# Altium schematic sheet Digit_Board.SchDoc
size A
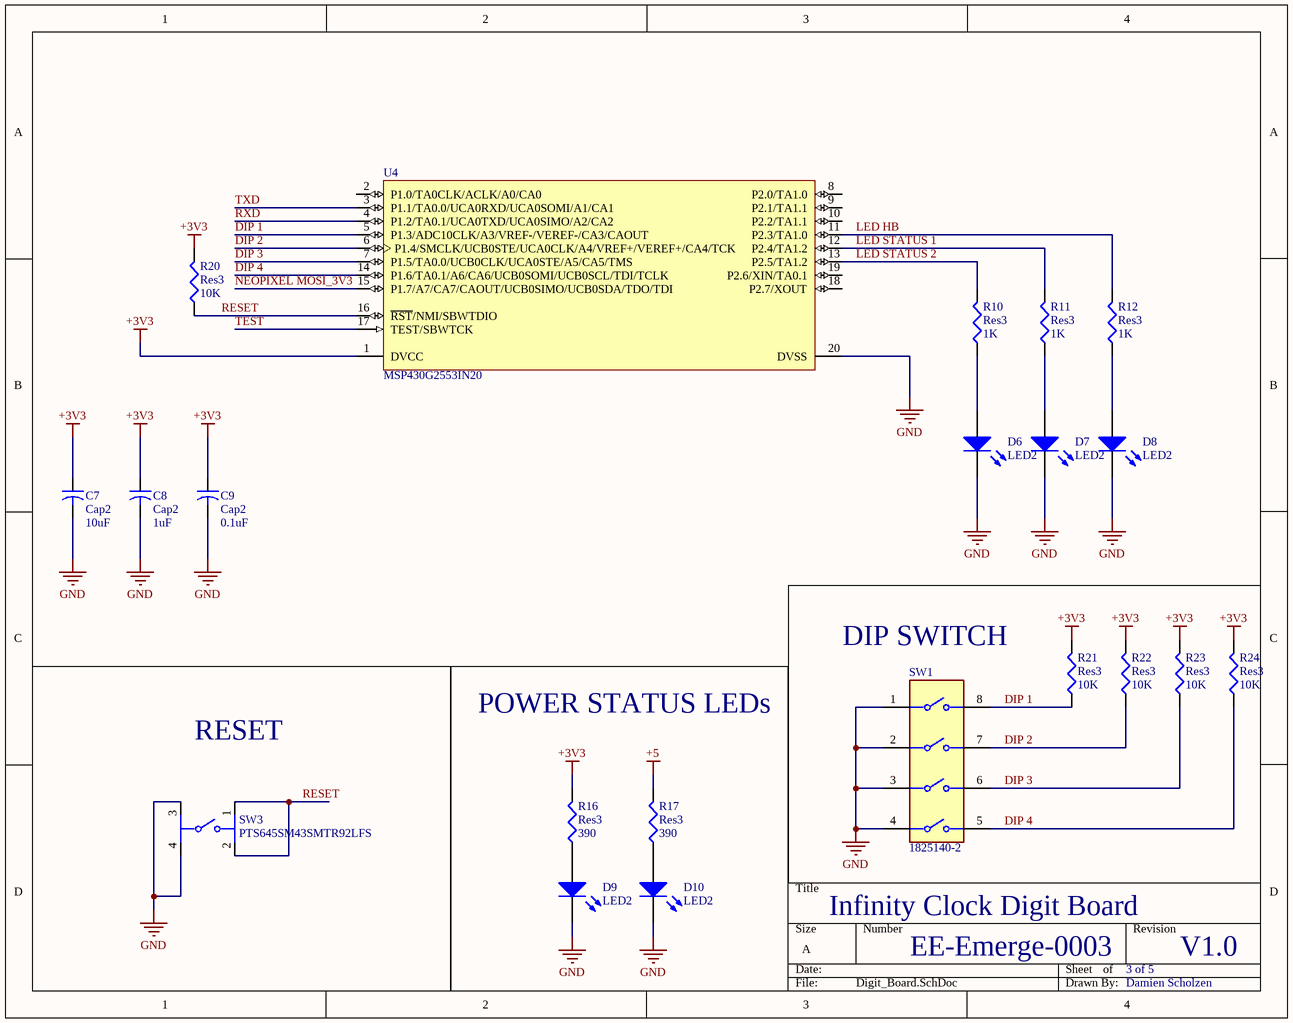
[diagram p0: Digit_Board.SchDoc]

## Parts
C7  Cap2  value 10uF  [C0805]
C8  Cap2  value 1uF  [C0805]
C9  Cap2  value 0.1uF  [C0805]
D6  LED2  [3.2X1.6X1.1]
D7  LED2  [3.2X1.6X1.1]
D8  LED2  [3.2X1.6X1.1]
D9  LED2  [3.2X1.6X1.1]
D10  LED2  [3.2X1.6X1.1]
R10  Res3  value 1K  [6-0805_N]
R11  Res3  value 1K  [6-0805_N]
R12  Res3  value 1K  [6-0805_N]
R16  Res3  value 390  [6-0805_N]
R17  Res3  value 390  [6-0805_N]
R20  Res3  value 10K  [6-0805_N]
R21  Res3  value 10K  [6-0805_N]
R22  Res3  value 10K  [6-0805_N]
R23  Res3  value 10K  [6-0805_N]
R24  Res3  value 10K  [6-0805_N]
SW1  1825140-2  [FP-1825140-2-MFG]
SW3  PTS645SM43SMTR92LFS  [FP-PTS645SM43SMTR92LFS-MFG]
U4  MSP430G2553IN20  [N0020A]

## Nets
+3V3: C7.1 C8.1 C9.1 R16.2 R20.2 R21.2 R22.2 R23.2 R24.2 U4.1(DVCC)
+5: R17.2
GND: C7.2 C8.2 C9.2 D6.2(K) D7.2(K) D8.2(K) D9.2(K) D10.2(K) SW1.1 SW1.2 SW1.3 SW1.4 SW3.3 SW3.4 U4.20(DVSS)
DIP 1: R21.1 SW1.8 U4.5(P1.3/ADC10CLK/A3/VREF-/VEREF-/CA3/CAOUT)
DIP 2: R22.1 SW1.7 U4.6(P1.4/SMCLK/UCB0STE/UCA0CLK/A4/VREF+/VEREF+/CA4/TCK)
DIP 3: R23.1 SW1.6 U4.7(P1.5/TA0.0/UCB0CLK/UCA0STE/A5/CA5/TMS)
DIP 4: R24.1 SW1.5 U4.14(P1.6/TA0.1/A6/CA6/UCB0SOMI/UCB0SCL/TDI/TCLK)
LED HB: R12.2 U4.11(P2.3/TA1.0)
LED STATUS 1: R11.2 U4.12(P2.4/TA1.2)
LED STATUS 2: R10.2 U4.13(P2.5/TA1.2)
NEOPIXEL MOSI_3V3: U4.15(P1.7/A7/CA7/CAOUT/UCB0SIMO/UCB0SDA/TDO/TDI)
RESET: R20.1 SW3.1 SW3.2 U4.16(~{RST}/NMI/SBWTDIO)
RXD: U4.4(P1.2/TA0.1/UCA0TXD/UCA0SIMO/A2/CA2)
TEST: U4.17(TEST/SBWTCK)
TXD: U4.3(P1.1/TA0.0/UCA0RXD/UCA0SOMI/A1/CA1)
NetD6_1: D6.1(A) R10.1
NetD7_1: D7.1(A) R11.1
NetD8_1: D8.1(A) R12.1
NetD9_1: D9.1(A) R16.1
NetD10_1: D10.1(A) R17.1

Not connected (* = marked no-connect by the designer): U4 2(P1.0/TA0CLK/ACLK/A0/CA0) 8(P2.0/TA1.0) 9(P2.1/TA1.1) 10(P2.2/TA1.1) 18(P2.7/XOUT) 19(P2.6/XIN/TA0.1)

## Notes on the sheet
- DIP SWITCH
- RESET
- POWER STATUS LEDs
- Infinity Clock Digit Board
- EE-Emerge-0003
- 3 of 5
- V1.0
- Damien Scholzen

## Library data of the parts
C7 = Cap2: Capacitor; Published: 23-Sep-2002; PackageReference: CAPR5-4X5; Publisher: Altium Limited; PackageDescription: Capacitor; 2 Leads
C8 = Cap2_1: Capacitor; Published: 23-Sep-2002; PackageReference: CAPR5-4X5; Publisher: Altium Limited; PackageDescription: Capacitor; 2 Leads
C9 = Cap2_2: Capacitor; Published: 23-Sep-2002; PackageReference: CAPR5-4X5; Publisher: Altium Limited; PackageDescription: Capacitor; 2 Leads
D6-D10 = LED2: Typical RED, GREEN, YELLOW, AMBER GaAs LED; Published: 8-Jun-2000; LatestRevisionDate: 17-Jul-2002; LatestRevisionNote: Re-released for DXP Platform.; PackageVersion: Feb-2002; PackageReference: 3.2X1.6X1.1; Publisher: Altium Limited; PackageDescription: SM LED; 2 Flat Leads
R10-R12 = Res3_2: Resistor; Published: 8-Jun-2000; LatestRevisionDate: 29-May-2009; LatestRevisionNote: IPC-7351 Footprint Added.; PackageReference: J1-0603; Publisher: Altium Limited; PackageDescription: Chip Resistor
R16 R17 = Res3_4: Resistor; Published: 8-Jun-2000; LatestRevisionDate: 29-May-2009; LatestRevisionNote: IPC-7351 Footprint Added.; PackageReference: J1-0603; Publisher: Altium Limited; PackageDescription: Chip Resistor
R20-R24 = Res3_3: Resistor; Published: 8-Jun-2000; LatestRevisionDate: 29-May-2009; LatestRevisionNote: IPC-7351 Footprint Added.; PackageReference: J1-0603; Publisher: Altium Limited; PackageDescription: Chip Resistor
SW1 = CMP-03400-000052-1: SWITCH SLIDE DIP SPST 25MA 24V; Pitch: 1.27mm; Actuator Type: Standard; Actuator Length: 0mm; Contact Current Rating: 100mA; Voltage Rating (DC): 50V; Electrical Life: 1000Cycles; Sealable: No (Without); Contact Resistance: 100mR; Washable: No; Number of Positions: 4; Actuator Material: Polymer; Max Current Rating: 25mA; Max Voltage Rating (DC): 24V; Series: MGDH; Housing Material: Polyphenylene; Length: 0.244inch; Package Quantity: 2000; Max Operating Temperature: 85°C; Contact Plating: Gold; Contact Material: Copper Alloy; Throw Configuration: SPST; Height: 1.7mm; Orientation: Straight; Housing Color: Black; Type: Switch; Mount: Surface Mount; Terminal Pitch: 1.27mm; Flammability Rating: UL94 V-0; Radiation Hardening: No; Packaging: Tape and Reel; Termination: Gull Wing; Min Operating Temperature: -30°C; RoHS Compliant: Yes
SW3 = CMP-2000-05160-2: SWITCH TACTILE SPST-NO 0.05A 12V; Contact Resistance: 100mR; Throw Configuration: SPST; Illumination Type: Non-Illuminated; Mechanical Life: 100000Cycles; Current Rating: 50mA; Switch Function: Off-Mom; Actuator Length: 0.85mm; Actuator Material: Nylon; Actuator Type: Standard; Operating Force: 160gf; Min Operating Temperature: -20°C; REACH SVHC: No SVHC; Termination: Gull Wing; Case/Package: SMD/SMT; Packaging: Tape and Reel; Mount: Surface Mount; Voltage Rating (DC): 12V; Orientation: Straight; Lead Free: Lead Free; Contact Material: Silver; Color: Black; Max Current Rating: 50mA; Contact Plating: Silver; Depth: 9mm; Package Quantity: 1; Max Voltage Rating (DC): 12V; Length: 6mm; Max Operating Temperature: 60°C
U4 = CMP-0365-00184-2: 16 MHz Mixed Signal Microcontroller with 16 KB Flash, 512 B SRAM and 24 GPIOs, -40 to 85 degC, 20-pin DIP (N), Pb-Free (RoHS); Manufacturer: Texas Instruments; USCI_B (I2C & SPI): 1; Temp Sensor: Yes; SubFamily: Value Line; Frequency(MHz): 16; ADC Channels: 8; SRAM(B): 512; ADC: 10-bit SAR; GPIO: 24; Timers - 16-bit: 2; Code_JEDEC: MS-001; Eco-Plan: Pb-Free (RoHS); PartNumber: MSP430G2553IN20; ComponentLink1URL: http://www.ti.com/; PackageVersion: 4040049/E; Comparators: Yes; Watchdog: Yes; ComponentLink2Description: Datasheet; ComponentLink1Description: Manufacturer URL; Mounting Technology: Through Hole; ComponentLink2URL: http://www.ti.com/general/docs/lit/getliterature.tsp?genericPartNumber=MSP430G2553&fileType=pdf; Brown Out Reset: Yes; PackageReference: N0020A; PackageDescription: 20-Pin Plastic In-Line, Body 25.40 x 6.35 mm, Pitch 2.54 mm; ComponentLink3URL: http://www.ti.com/litv/pdf/mpds177g; ComponentLink3Description: Package Specification; Flash(KB): 16; Cap touch I/O: Yes; USCI_A (UART/LIN/IrDA/SPI): 1; DatasheetVersion: SLAS735G; Manufacturer 1: Texas Instruments; Manufacturer Part Number 1: MSP430G2553IN20